# Altium schematic sheet 峰值检测.SchDoc
size A4
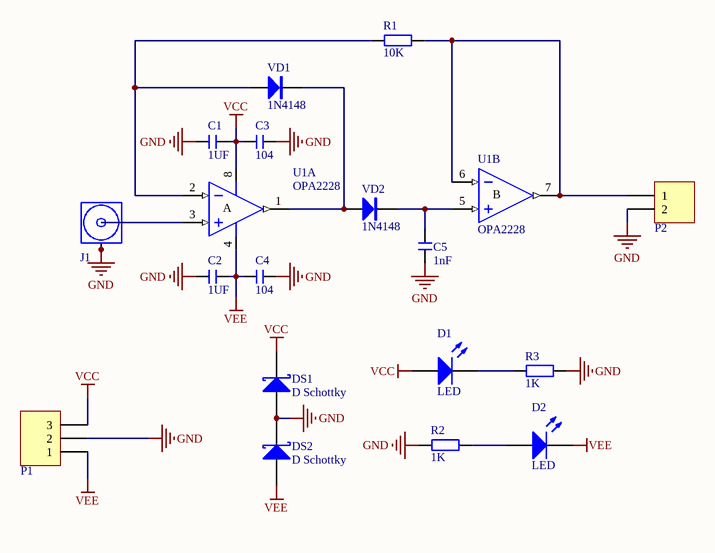
[diagram p0: 峰值检测.SchDoc]

## Parts
C1  1UF  [C 0603]
C2  1UF  [C 0603]
C3  104  [C 0603]
C4  104  [C 0603]
C5  1nF  [C 0603]
D1  LED  [LED_0805]
D2  LED  [LED_0805]
DS1  D Schottky  [DIODE-SMA]
DS2  D Schottky  [DIODE-SMA]
J1  COAX  [MCX5.08-5-H]  (value not drawn)
P1  Header 3  [HDR3X1_B2]  (value not drawn)
P2  Header 2  [HDR2X1_B2]  (value not drawn)
R1  10K  [R 0603]
R2  1K  [R 0805]
R3  1K  [R 0805]
U1  OPA2228  [SOIC8_N]  (parts A,B of 2)
VD1  1N4148  [SOD-323]
VD2  1N4148  [SOD-323]

## Nets
GND: C1.2 C2.2 C3.1 C4.1 C5.1 DS1.1 DS2.2 J1.2(GND) J1.3(GND) J1.4(GND) J1.5(GND) P1.2 P2.2 R2.1 R3.2
VCC: C1.1 C3.2 D1.1(A) DS1.2 P1.3 U1.8(V+)
VEE: C2.1 C4.2 D2.2(K) DS2.1 P1.1 U1.4(V-)
NetC5_2: C5.2 U1.5(IN+) VD2.2(K)
NetD1_2: D1.2(K) R3.1
NetD2_1: D2.1(A) R2.2
NetJ1_1: J1.1(Signal) U1.3(IN+)
NetP2_1: P2.1 R1.2 U1.6(IN-) U1.7(OUT)
NetR1_1: R1.1 U1.2(IN-) VD1.1(A)
NetU1_1: U1.1(OUT) VD1.2(K) VD2.1(A)

## Notes on the sheet
- (in symbol OPA2228, part A) A
- (in symbol OPA2228, part B) B

## Library data of the parts
C1-C5 = C: 无极性贴片电容; 版权归属: 源创客; BOM名称: 无极性贴片电容; 学习资源: www.ooocke.com
D1 D2 = LED: 发光二极管; Published: 8-Jun-2000; LatestRevisionDate: 08-Jul-2005; LatestRevisionNote: Mech Layer 1 removed.; PackageReference: LED; Publisher: Altium Limited
DS1 DS2 = D Schottky: Schottky Diode; Published: 8-Jun-2000; LatestRevisionDate: 17-Jul-2002; LatestRevisionNote: Re-released for DXP Platform.; PackageReference: SMB; Publisher: Altium Limited; PackageDescription: DO-214-AA/SMB; 2 C-Bend Leads; Body 5.3 x 3.6 mm, inc. leads (LxW); Code_JEDEC: DO-214-AA
P1 = Header 3: 接插件; LatestRevisionDate: 17-Jul-2002; LatestRevisionNote: Re-released for DXP Platform.; Publisher: Altium Limited
P2 = Header 2: 接插件; LatestRevisionDate: 17-Jul-2002; LatestRevisionNote: Re-released for DXP Platform.; Publisher: Altium Limited
R1-R3 = R: 贴片电阻; 版权归属: 源创客; BOM名称: 贴片电阻; 学习资源: www.ooocke.com
U1 = OPA2228: 高精度低噪声运算放大器
VD1 VD2 = 1N4148: 高速开关二极管; 版权归属: 源创客; BOM名称: 高速开关二极管; 学习资源: www.ooocke.com